# Altium project LAB_COATING COF_MACHINE.PrjPcb
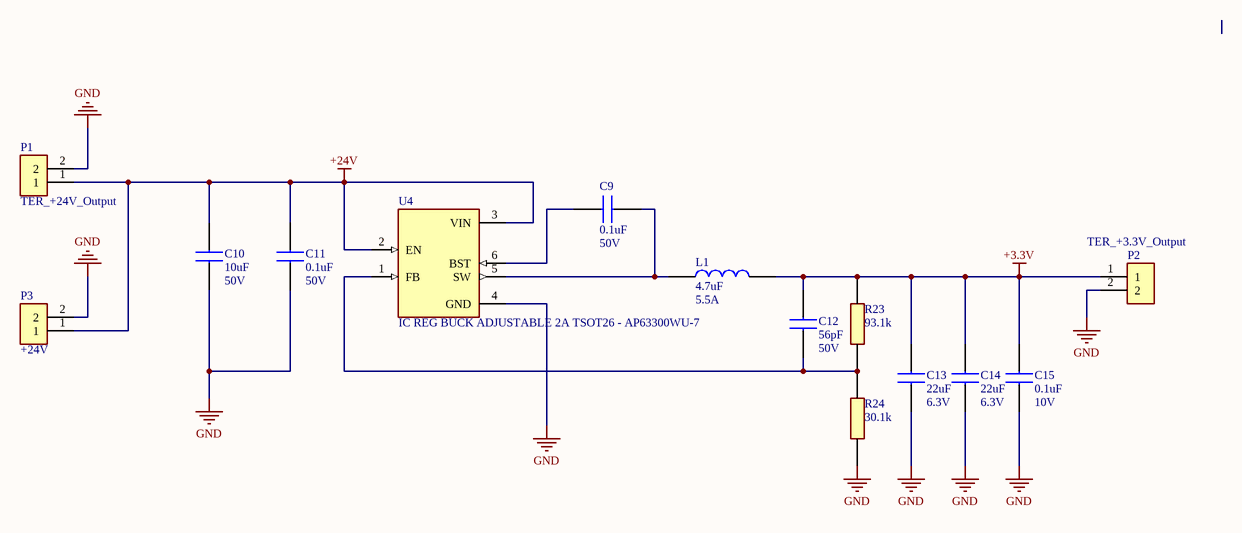
[diagram p0: Sche_Voltage regulator.SchDoc]
3 sheets, 59 parts. Net scope: global (net labels, ports and power ports of the same name join across sheets).
Board file: PCB_COF_1.2.PcbDoc
Sheets:
  Sche_Voltage regulator.SchDoc
  Sche_MCU_IO.SchDoc
  Sche_PheriperalSchDoc.SchDoc

## Sheet Sche_Voltage regulator.SchDoc
size A

### Parts
C9  0.1uF  [C 0603]
C10  10uF  [CAPC3225X290N]
C11  0.1uF  [C 0603]
C12  56pF  [CAPC1005X55N]
C13  22uF  [C 0603]
C14  22uF  [C 0603]
C15  0.1uF  [CAPC1608X95N]
L1  4.7uF  [INDM6965X300N]
P1  Comment_1: TER_+24V_Output  [TE_282837-2]  (hidden comment: TERM BLK 2P SIDE ENT 5.08MM PCB - 282837-2)
P2  Comment_1: TER_+3.3V_Output  [TE_282837-2]  (hidden comment: 282837-2)
P3  Comment_1: +24V  [TE_282837-2]  (hidden comment: 282837-2)
R23  93.1k  [RESC1005X40N]
R24  30.1k  [ERJ2RKD1004X]
U4  IC REG BUCK ADJUSTABLE 2A TSOT26 - AP63300WU-7  [SOT95P280X100-6N]

### Nets
+3.3V: C12.2 C13.2 C14.2 C15.2 L1.2 P2.1 R23.2
+24V: C10.2 C11.2 P1.1 P3.1 U4.2(EN) U4.3(VIN)
GND: C10.1 C11.1 C13.1 C14.1 C15.1 P1.2 P2.2 P3.2 R24.1 U4.4(GND)
NetC9_1: C9.1 U4.6(BST)
NetC9_2: C9.2 L1.1 U4.5(SW)
NetC12_1: C12.1 R23.1 R24.2 U4.1(FB)

### Notes on the sheet
- (in symbol CAP CER 0.1UF 10V X7R 0603 - C0603C104K8RACTU) 10V
- (in symbol CAP CER 0.1UF 50V X7R 0603 - ESD35C104K4T2A-24) 50V
- (in symbol CAP CER 10UF 50V Y5V 1210 - 12105G106ZAT2A) 50V
- (in symbol CAP CER 22UF 6.3V X5R 0603 - GRM188R60J226MEA0D) 6.3V
- (in symbol CAP CER 56PF 50V C0G/NPO 0402 - CC0402JRNPO9BN560) 50V
- (in symbol IND 4.7UH 5.5A 40 MOHM SMD - IHLP2525CZER4R7M01) 5.5A

### Library data of the parts
C9 C11 = CAP CER 0.1UF 50V X7R 0603 - ESD35C104K4T2A-24: CAP CER 0.1UF 50V X7R 0603; Catalog: ESD35C104K4T2A-24
C10 = CAP CER 10UF 50V Y5V 1210 - 12105G106ZAT2A: CAP CER 10UF 50V Y5V 1210; Manufacturer_Name: AVX; Manufacturer_Part_Number: 12105G106ZAT2A/500; Geometry.Height: 2.9mm; Mouser Part Number: *; Mouser Price/Stock: *; Arrow Part Number: *; Arrow Price/Stock: *; Datasheet Link: http://datasheets.avx.com/Y5V.pdf
C12 = CAP CER 56PF 50V C0G/NPO 0402 - CC0402JRNPO9BN560: CAP CER 56PF 50V C0G/NPO 0402; Manufacturer_Name: KEMET; Geometry.Height: 0.55mm; Manufacturer_Part_Number: CC0402JRNPO9BN560; Mouser Part Number: *; Mouser Price/Stock: *; Arrow Part Number: CC0402JRNPO9BN560; Arrow Price/Stock: https://www.arrow.com/en/products/cc0402jrnpo9bn560/yageo; Datasheet Link: https://www.yageo.com/upload/media/product/productsearch/datasheet/mlcc/UPY-GP_NP0_16V-to-50V_18.pdf
C13 C14 = CAP CER 22UF 6.3V X5R 0603 - GRM188R60J226MEA0D: CAP CER 22UF 6.3V X5R 0603; Catalog: GRM188R60J226MEA0D
C15 = CAP CER 0.1UF 10V X7R 0603 - C0603C104K8RACTU: Multilayer Ceramic Capacitors MLCC - SMD/SMT; Manufacturer_Name: KEMET; Manufacturer_Part_Number: C0603C104K8RACTU/1K; Geometry.Height: 0.95mm; Mouser Part Number: N/A; Mouser Price/Stock: https://www.mouser.com/Search/Refine.aspx?Keyword=N%2FA; Arrow Part Number: *; Arrow Price/Stock: *; Datasheet Link: https://api.kemet.com/component-edge/download/specsheet/C0603C104K8RACTU.pdf
L1 = IND 4.7UH 5.5A 40 MOHM SMD - IHLP2525CZER4R7M01: FIXED IND 4.7UH 5.5A 40 MOHM SMD; Manufacturer_Name: Vishay; Geometry.Height: 3mm; Manufacturer_Part_Number: IHLP2525CZER4R7M01; Mouser Part Number: 70-IHLP2525CZER4R7M1; Mouser Price/Stock: https://www.mouser.co.uk/ProductDetail/Vishay-Dale/IHLP2525CZER4R7M01?qs=delkvkPykKkoRC4%2FTC3qyQ%3D%3D; Arrow Part Number: IHLP2525CZER4R7M01; Arrow Price/Stock: https://www.arrow.com/en/products/ihlp2525czer4r7m01/vishay?region=europe; Datasheet Link: https://componentsearchengine.com/Datasheets/2/IHLP2525CZER4R7M01.pdf
P1 = TERM BLK 2P SIDE ENT 5.08MM PCB - 282837-2: TERM BLK 2P SIDE ENT 5.08MM PCB; MF: TE Connectivity; Check_prices: https://www.snapeda.com/parts/282837-2/TE+Connectivity+AMP+Connectors/view-part/?ref=eda; Value: *; Availability: In Stock; MP: 282837-2; Price: None; Package: None; SnapEDA_Link: https://www.snapeda.com/parts/282837-2/TE+Connectivity+AMP+Connectors/view-part/?ref=snap; Purchase-URL: https://pricing.snapeda.com/search/part/282837-2/?ref=eda
P2 P3 = 282837-2: Connector Terminal Blocks Receptacle 2 Position 5.08mm Solder Straight Thru-Hole 13.5A/Contact; MF: TE Connectivity; Check_prices: https://www.snapeda.com/parts/282837-2/TE+Connectivity+AMP+Connectors/view-part/?ref=eda; Value: *; Availability: In Stock; MP: 282837-2; Price: None; Package: None; SnapEDA_Link: https://www.snapeda.com/parts/282837-2/TE+Connectivity+AMP+Connectors/view-part/?ref=snap; Purchase-URL: https://pricing.snapeda.com/search/part/282837-2/?ref=eda
R23 = RES 93.1K OHM 1% 1/16W 0402 - RC0402FR-0793K1L: RES 93.1K OHM 1% 1/16W 0402; Manufacturer_Name: KEMET; Geometry.Height: 0.4mm; Manufacturer_Part_Number: RC0402FR-0793K1L; Mouser Part Number: 603-RC0402FR-0793K1L; Mouser Price/Stock: *; Arrow Part Number: *; Arrow Price/Stock: *; Datasheet Link: http://www.yageo.com/documents/recent/PYu-RC0402_51_RoHS_L_6_r.pdf
R24 = RES SMD 30.1K OHM 1% 1/10W 0402 - ERJ-2RKF3012X: RES SMD 30.1K OHM 1% 1/10W 0402; Manufacturer_Name: Panasonic; Geometry.Height: 0.4mm; Manufacturer_Part_Number: ERJ-2RKF3012X; Mouser Part Number: 667-ERJ-2RKF3012X; Mouser Price/Stock: https://www.mouser.co.uk/ProductDetail/Panasonic/ERJ-2RKF3012X?qs=YMBIwoNQYdWdJYigM0pxkw%3D%3D; Arrow Part Number: *; Arrow Price/Stock: *; Datasheet Link: https://industrial.panasonic.com/cdbs/www-data/pdf/RDA0000/AOA0000C86.pdf
U4 = IC REG BUCK ADJUSTABLE 2A TSOT26 - AP63300WU-7: IC REG BUCK ADJUSTABLE 2A TSOT26; MF: Diodes Incorporated; SnapEDA_Link: https://www.snapeda.com/parts/AP63300WU-7/Diodes%20Inc./view-part/4221814/?ref=snap; Availability: Unavailable; MP: AP63300WU-7; DigiKey-Purchase-URL: https://snapeda.com/shop?store=DigiKey&id=4221814; Price: None; Value: *; Package: SOT-23-6 Diodes Incorporated

## Sheet Sche_MCU_IO.SchDoc
size A
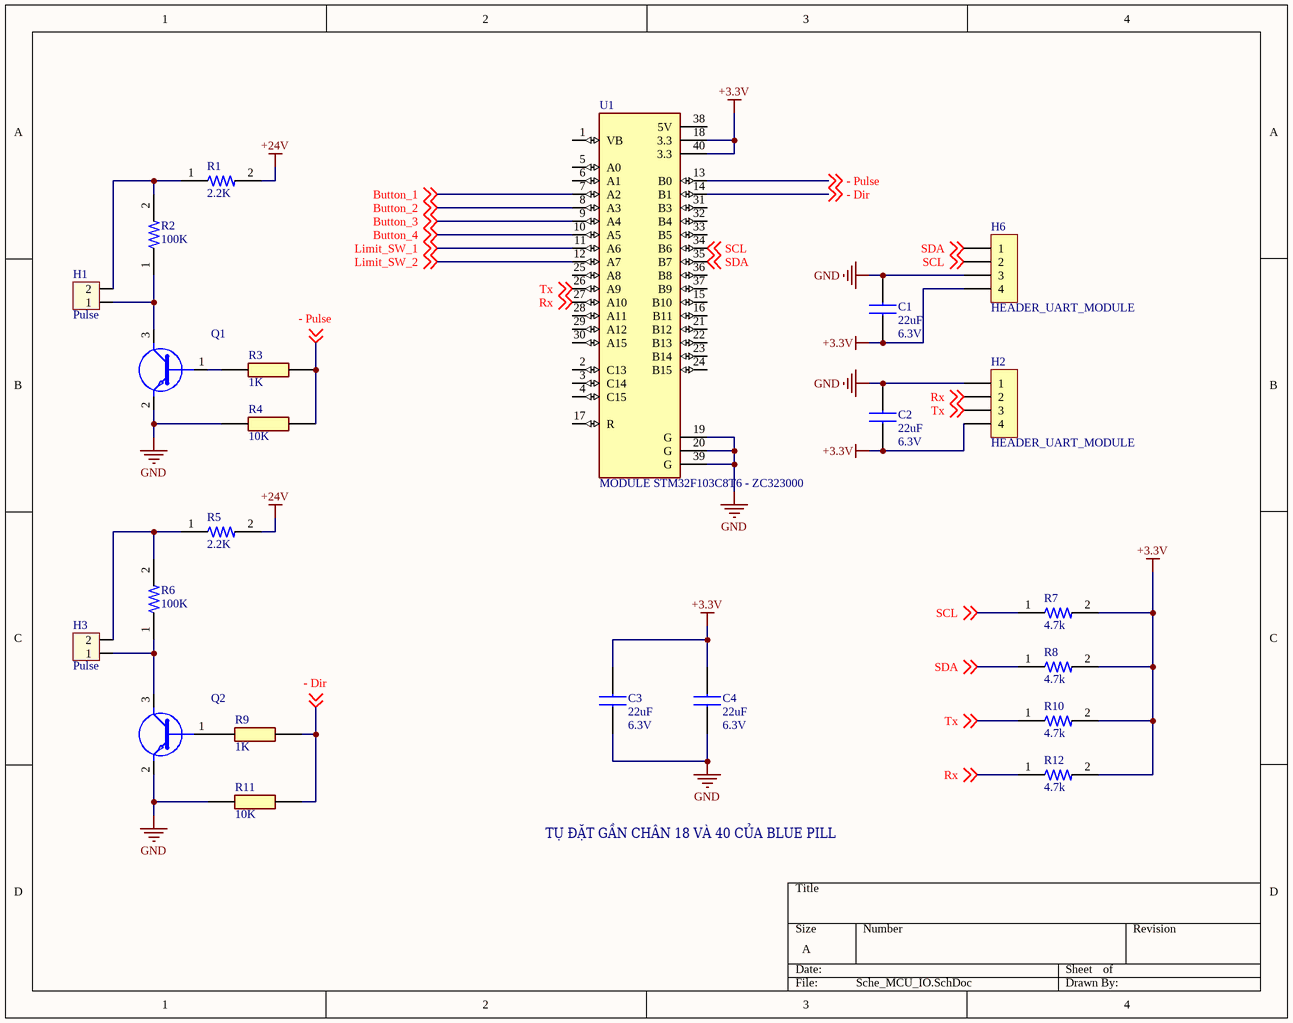
[diagram p1: Sche_MCU_IO.SchDoc]

### Parts
C1  22uF  [C 0603]
C2  22uF  [C 0603]
C3  22uF  [C 0603]
C4  22uF  [C 0603]
H1  Pulse  [Header 2P DC 2.54]
H2  HEADER_UART_MODULE  [XH2.54M-4]
H3  Pulse  [Header 2P DC 2.54]
H6  HEADER_UART_MODULE  [XH2.54M-4]
Q1  TRANS NPN 45V 0.8A SOT23-3 - BCW66GLT1G  [SOT95P237X111-3N]  (value not drawn)
Q2  TRANS NPN 45V 0.8A SOT23-3 - BCW66GLT1G  [SOT95P237X111-3N]  (value not drawn)
R1  2.2K  [RES 0805]
R2  100K  [Res 0603]
R3  1K  [ERJ3EKF1000V]
R4  10K  [ERJ3EKF1000V]
R5  2.2K  [RES 0805]
R6  100K  [Res 0603]
R7  4.7k  [Res 0603]
R8  4.7k  [Res 0603]
R9  1K  [ERJ3EKF1000V]
R10  4.7k  [Res 0603]
R11  10K  [ERJ3EKF1000V]
R12  4.7k  [Res 0603]
U1  MODULE STM32F103C8T6 - ZC323000  [MODULE_ZC323000]

### Nets
+3.3V: C1.1 C2.1 C3.2 C4.2 H2.4 H6.4 R7.2 R8.2 R10.2 R12.2 U1.18(3.3) U1.40(3.3)
+24V: R1.2 R5.2
GND: C1.2 C2.2 C3.1 C4.1 H2.1 H6.3 Q1.2(E) Q2.2(E) R4.1 R11.1 U1.19(G) U1.20(G) U1.39(G)
- Dir: R9.2 R11.2 U1.14(B1) ; off-sheet - Dir
- Pulse: R3.2 R4.2 U1.13(B0) ; off-sheet - Pulse
Button_1: U1.7(A2) ; off-sheet Button_1
Button_2: U1.8(A3) ; off-sheet Button_2
Button_3: U1.9(A4) ; off-sheet Button_3
Button_4: U1.10(A5) ; off-sheet Button_4
Limit_SW_1: U1.11(A6) ; off-sheet Limit_SW_1
Limit_SW_2: U1.12(A7) ; off-sheet Limit_SW_2
Rx: H2.2 R12.1 U1.27(A10) ; off-sheet Rx
SCL: H6.2 R7.1 U1.34(B6) ; off-sheet SCL
SDA: H6.1 R8.1 U1.35(B7) ; off-sheet SDA
Tx: H2.3 R10.1 U1.26(A9) ; off-sheet Tx
NetH1_1: H1.1 Q1.3(C) R2.1
NetH1_2: H1.2 R1.1 R2.2
NetH3_1: H3.1 Q2.3(C) R6.1
NetH3_2: H3.2 R5.1 R6.2
NetQ1_1: Q1.1(B) R3.1
NetQ2_1: Q2.1(B) R9.1

Not connected (* = marked no-connect by the designer): U1 1(VB) 2(C13) 3(C14) 4(C15) 5(A0) 6(A1) 15(B10) 16(B11) 17(R) 21(B12) 22(B13) 23(B14) 24(B15) 25(A8) 28(A11) 29(A12) 30(A15) 31(B3) 32(B4) 33(B5) 36(B8) 37(B9) 38(5V)

### Notes on the sheet
- TỤ ĐẶT GẦN CHÂN 18 VÀ 40 CỦA BLUE PILL
- (in symbol CAP CER 22UF 6.3V X5R 0603 - GRM188R60J226MEA0D) 6.3V

### Library data of the parts
C1-C4 = CAP CER 22UF 6.3V X5R 0603 - GRM188R60J226MEA0D: CAP CER 22UF 6.3V X5R 0603; Catalog: GRM188R60J226MEA0D
H1 H3 = Header 2P 2.54 Duc Cong: Cắm; Ten_Linh_Kien: Header 2P XH2.54-2P Đực Cong; Don_Vi: Con; Ma_Hang: MH002852; Chung_Loai: Cắm
H2 H6 = Header 4P 2.54 Duc Thang: Cắm; Ten_Linh_Kien: Header 4P XH2.54-4P Đực Thẳng; Don_Vi: Con; Ma_Hang: MH001285; Chung_Loai: Cắm
Q1 Q2 = TRANS NPN 45V 0.8A SOT23-3 - BCW66GLT1G: TRANS NPN 45V 0.8A SOT23-3; Manufacturer_Name: onsemi; Geometry.Height: 1.11mm; Manufacturer_Part_Number: BCW66GLT1G; Mouser Part Number: 863-BCW66GLT1G; Mouser Price/Stock: https://www.mouser.co.uk/ProductDetail/onsemi/BCW66GLT1G?qs=R2UZ7gjkEjKs0bN2RlXbWw%3D%3D; Arrow Part Number: BCW66GLT1G; Arrow Price/Stock: https://www.arrow.com/en/products/bcw66glt1g/on-semiconductor?region=nac; Datasheet Link: http://www.onsemi.com/pub/Collateral/BCW66GLT1-D.PDF
R1 R5 = RES SMD 2.2K OHM 5% 1/2W 0805 - ERJ-P06J222V: RES SMD 2.2K OHM 5% 1/2W 0805; MF: PANASONIC; MP: ERJ-P06J222V
R2 R6 = RES SMD 100K OHM 1% 1/10W 0603 - CRCW0603100KFKEA: RES SMD 100K OHM 1% 1/10W 0603; MF: Yageo; MP: CRCW0603100KFKEA
R3 R9 = RES SMD 1K OHM 5% 1/10W 0603 - ERJ-3GEYJ102V: RES SMD 1K OHM 5% 1/10W 0603; Manufacturer_Name: Panasonic; Geometry.Height: 0.55mm; Manufacturer_Part_Number: ERJ-3GEYJ102V; Mouser Part Number: 667-ERJ-3GEYJ102V; Mouser Price/Stock: https://www.mouser.co.uk/ProductDetail/Panasonic/ERJ-3GEYJ102V?qs=66DK8nO8gJBFiTsClorqsA%3D%3D; Arrow Part Number: ERJ-3GEYJ102V; Arrow Price/Stock: https://www.arrow.com/en/products/erj-3geyj102v/panasonic?region=nac; Datasheet Link: http://docs-europe.electrocomponents.com/webdocs/13ba/0900766b813ba21b.pdf
R4 R11 = RES SMD 10K OHM 5% 1/10W 0603 - ERJ3GEYJ103V: RES SMD 10K OHM 5% 1/10W 0603; Manufacturer_Name: Panasonic; Geometry.Height: 0.55mm; Manufacturer_Part_Number: ERJ3GEYJ103V; Mouser Part Number: 667-ERJ-3GEYJ103V; Mouser Price/Stock: http://www.mouser.com/Search/ProductDetail.aspx?qs=66DK8nO8gJBWgc%252b0VNNxzg%3d%3d; Arrow Part Number: *; Arrow Price/Stock: *; Datasheet Link: http://docs-europe.electrocomponents.com/webdocs/13ba/0900766b813ba21b.pdf
R7 R8 R10 R12 = RES 4.7K OHM 1% 1/10W 0603 - RC0603FR-074K7L: RES 4.7K OHM 1% 1/10W 0603; MF: Yageo; Value: *; SnapEDA_Link: https://www.snapeda.com/parts/RC0603FR-074K7L/Yageo/view-part/473520/?ref=snap; MP: RC0603FR-074K7L; Availability: Unavailable; Price: None; Package: 0603 Yageo
U1 = MODULE STM32F103C8T6 - ZC323000: MODULE STM32F103C8T6; Package: None; MP: ZC323000; Value: *; Availability: Unavailable; Price: None

## Sheet Sche_PheriperalSchDoc.SchDoc
size A
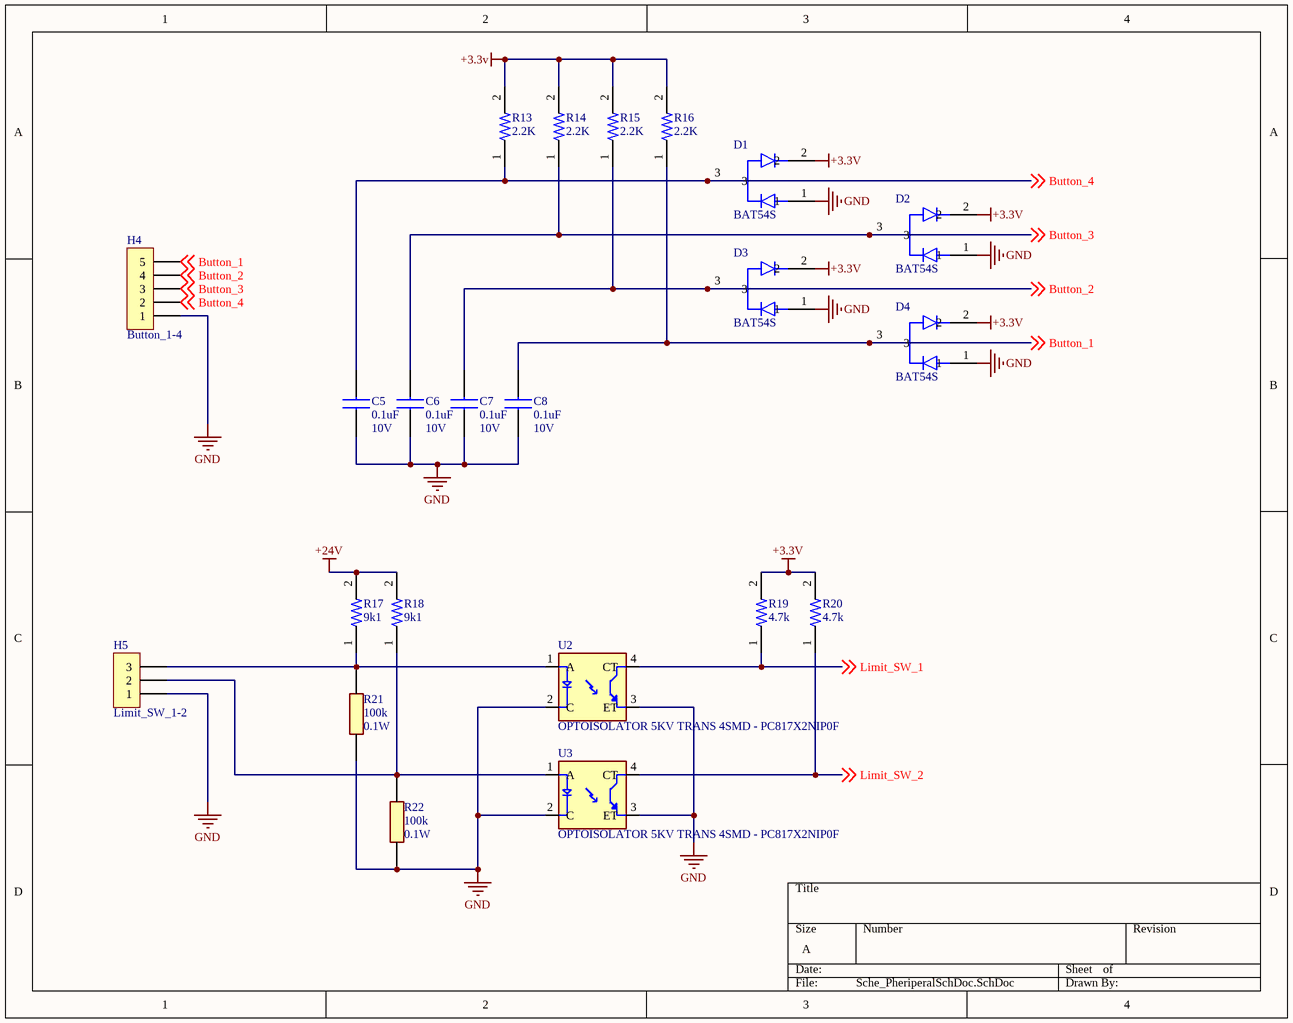
[diagram p2: Sche_PheriperalSchDoc.SchDoc]

### Parts
C5  0.1uF  [CAPC1608X95N]
C6  0.1uF  [CAPC1608X95N]
C7  0.1uF  [CAPC1608X95N]
C8  0.1uF  [CAPC1608X95N]
D1  BAT54S  [SOT95P240X120-3N]
D2  BAT54S  [SOT95P240X120-3N]
D3  BAT54S  [SOT95P240X120-3N]
D4  BAT54S  [SOT95P240X120-3N]
H4  Button_1-4  [Header 5P DC 2.54]
H5  Limit_SW_1-2  [Header 3P DC 2.54]
R13  2.2K  [RES 0805]
R14  2.2K  [RES 0805]
R15  2.2K  [RES 0805]
R16  2.2K  [RES 0805]
R17  9k1  [Res 0603]
R18  9k1  [Res 0603]
R19  4.7k  [Res 0603]
R20  4.7k  [Res 0603]
R21  100k  [ERJ2RKD1004X]
R22  100k  [ERJ2RKD1004X]
U2  OPTOISOLATOR 5KV TRANS 4SMD - PC817X2NIP0F  [SOT254P975X400-4N]
U3  OPTOISOLATOR 5KV TRANS 4SMD - PC817X2NIP0F  [SOT254P975X400-4N]

### Nets
+3.3V: D1.2 D2.2 D3.2 D4.2 R13.2 R14.2 R15.2 R16.2 R19.2 R20.2
+24V: R17.2 R18.2
GND: C5.1 C6.1 C7.1 C8.1 D1.1 D2.1 D3.1 D4.1 H4.1 H5.1 R21.1 R22.1 U2.2(C) U2.3(ET) U3.2(C) U3.3(ET)
Button_1: C8.2 D4.3 H4.5 R16.1 ; off-sheet Button_1
Button_2: C7.2 D3.3 H4.4 R15.1 ; off-sheet Button_2
Button_3: C6.2 D2.3 H4.3 R14.1 ; off-sheet Button_3
Button_4: C5.2 D1.3 H4.2 R13.1 ; off-sheet Button_4
Limit_SW_1: R19.1 U2.4(CT) ; off-sheet Limit_SW_1
Limit_SW_2: R20.1 U3.4(CT) ; off-sheet Limit_SW_2
NetH5_2: H5.2 R18.1 R22.2 U3.1(A)
NetH5_3: H5.3 R17.1 R21.2 U2.1(A)

### Notes on the sheet
- (in symbol CAP CER 0.1UF 10V X7R 0603 - C0603C104K8RACTU) 10V
- (in symbol RES SMD 100K OHM 1% 1/10W 0402 - ERJ2RKF1003X) 0.1W

### Library data of the parts
C5-C8 = CAP CER 0.1UF 10V X7R 0603 - C0603C104K8RACTU: as C15 on sheet Sche_Voltage regulator; Mouser Part Number: N/A; Mouser Price/Stock: https://www.mouser.com/Search/Refine.aspx?Keyword=N%2FA; Arrow Part Number: *; Arrow Price/Stock: *; Datasheet Link: https://api.kemet.com/component-edge/download/specsheet/C0603C104K8RACTU.pdf
D1-D4 = DIODE SCHOTTKY 30V 150MA SOT23  - BAT54S: DIODE SCHOTTKY 30V 150MA SOT23; Package: None; MP: BAT54S; Value: *; Availability: Unavailable; Price: None
H4 = Header 5P 2.54 Duc Cong: Cắm; Ten_Linh_Kien: Header 5P XH2.54-5P Đực Cong; Don_Vi: Con; Ma_Hang: MH001308; Chung_Loai: Cắm
H5 = Header 3P 2.54 Duc Cong: Cắm; Ten_Linh_Kien: Header 3P XH2.54-3P Đực Cong; Don_Vi: Con; Ma_Hang: MH001302; Chung_Loai: Cắm
R13-R16 = RES SMD 2.2K OHM 5% 1/2W 0805 - ERJ-P06J222V: as R1 on sheet Sche_MCU_IO; MP: ERJ-P06J222V
R17 R18 = RES SMD 9.1K OHM 1% 1/10W 0603 - ERJ-3EKF9101V: RES SMD 9.1K OHM 1% 1/10W 0603; MF: Panasonic; MP: ERJ-3EKF9101V
R19 R20 = RES 4.7K OHM 1% 1/10W 0603 - RC0603FR-074K7L: RES 4.7K OHM 1% 1/10W 0603; MF: Yageo; Value: *; SnapEDA_Link: https://www.snapeda.com/parts/RC0603FR-074K7L/Yageo/view-part/473520/?ref=snap; MP: RC0603FR-074K7L; Availability: Unavailable; Price: None; Package: 0603 Yageo
R21 R22 = RES SMD 100K OHM 1% 1/10W 0402 - ERJ2RKF1003X: RES SMD 100K OHM 1% 1/10W 0402; Manufacturer_Name: Panasonic; Geometry.Height: 0.4mm; Manufacturer_Part_Number: ERJ2RKF1003X; Mouser Part Number: *; Mouser Price/Stock: *; Arrow Part Number: *; Arrow Price/Stock: *; Datasheet Link: http://docs-europe.electrocomponents.com/webdocs/13ba/0900766b813ba21b.pdf
U2 U3 = OPTOISOLATOR 5KV TRANS 4SMD - PC817X2NIP0F: Optoisolator Transistor Output 5000Vrms 1 Channel 4-SMD; MF: Sharp Microelectronics; Value: *; SnapEDA_Link: https://www.snapeda.com/parts/PC817X2NIP0F/Sharp+Microelectronics/view-part/?ref=snap; Purchase-URL: https://pricing.snapeda.com/search/part/PC817X2NIP0F/?ref=eda; Check_prices: https://www.snapeda.com/parts/PC817X2NIP0F/Sharp+Microelectronics/view-part/?ref=eda; Digi-Key_Part_Number: 425-2192-2-ND; Package: SMD-4 Sharp; MP: PC817X2NIP0F

## Nets that join several sheets
+3.3V: Sche_Voltage regulator (7 pins), Sche_MCU_IO (12 pins), Sche_PheriperalSchDoc (10 pins)
+24V: Sche_Voltage regulator (6 pins), Sche_MCU_IO (R1.2 R5.2), Sche_PheriperalSchDoc (R17.2 R18.2)
GND: Sche_Voltage regulator (10 pins), Sche_MCU_IO (13 pins), Sche_PheriperalSchDoc (16 pins)
Button_1: Sche_MCU_IO (U1.7), Sche_PheriperalSchDoc (C8.2 D4.3 H4.5 R16.1)
Button_2: Sche_MCU_IO (U1.8), Sche_PheriperalSchDoc (C7.2 D3.3 H4.4 R15.1)
Button_3: Sche_MCU_IO (U1.9), Sche_PheriperalSchDoc (C6.2 D2.3 H4.3 R14.1)
Button_4: Sche_MCU_IO (U1.10), Sche_PheriperalSchDoc (C5.2 D1.3 H4.2 R13.1)
Limit_SW_1: Sche_MCU_IO (U1.11), Sche_PheriperalSchDoc (R19.1 U2.4)
Limit_SW_2: Sche_MCU_IO (U1.12), Sche_PheriperalSchDoc (R20.1 U3.4)